# EAGLE design Switch-N-Sense (EAGLE 8.0.1)
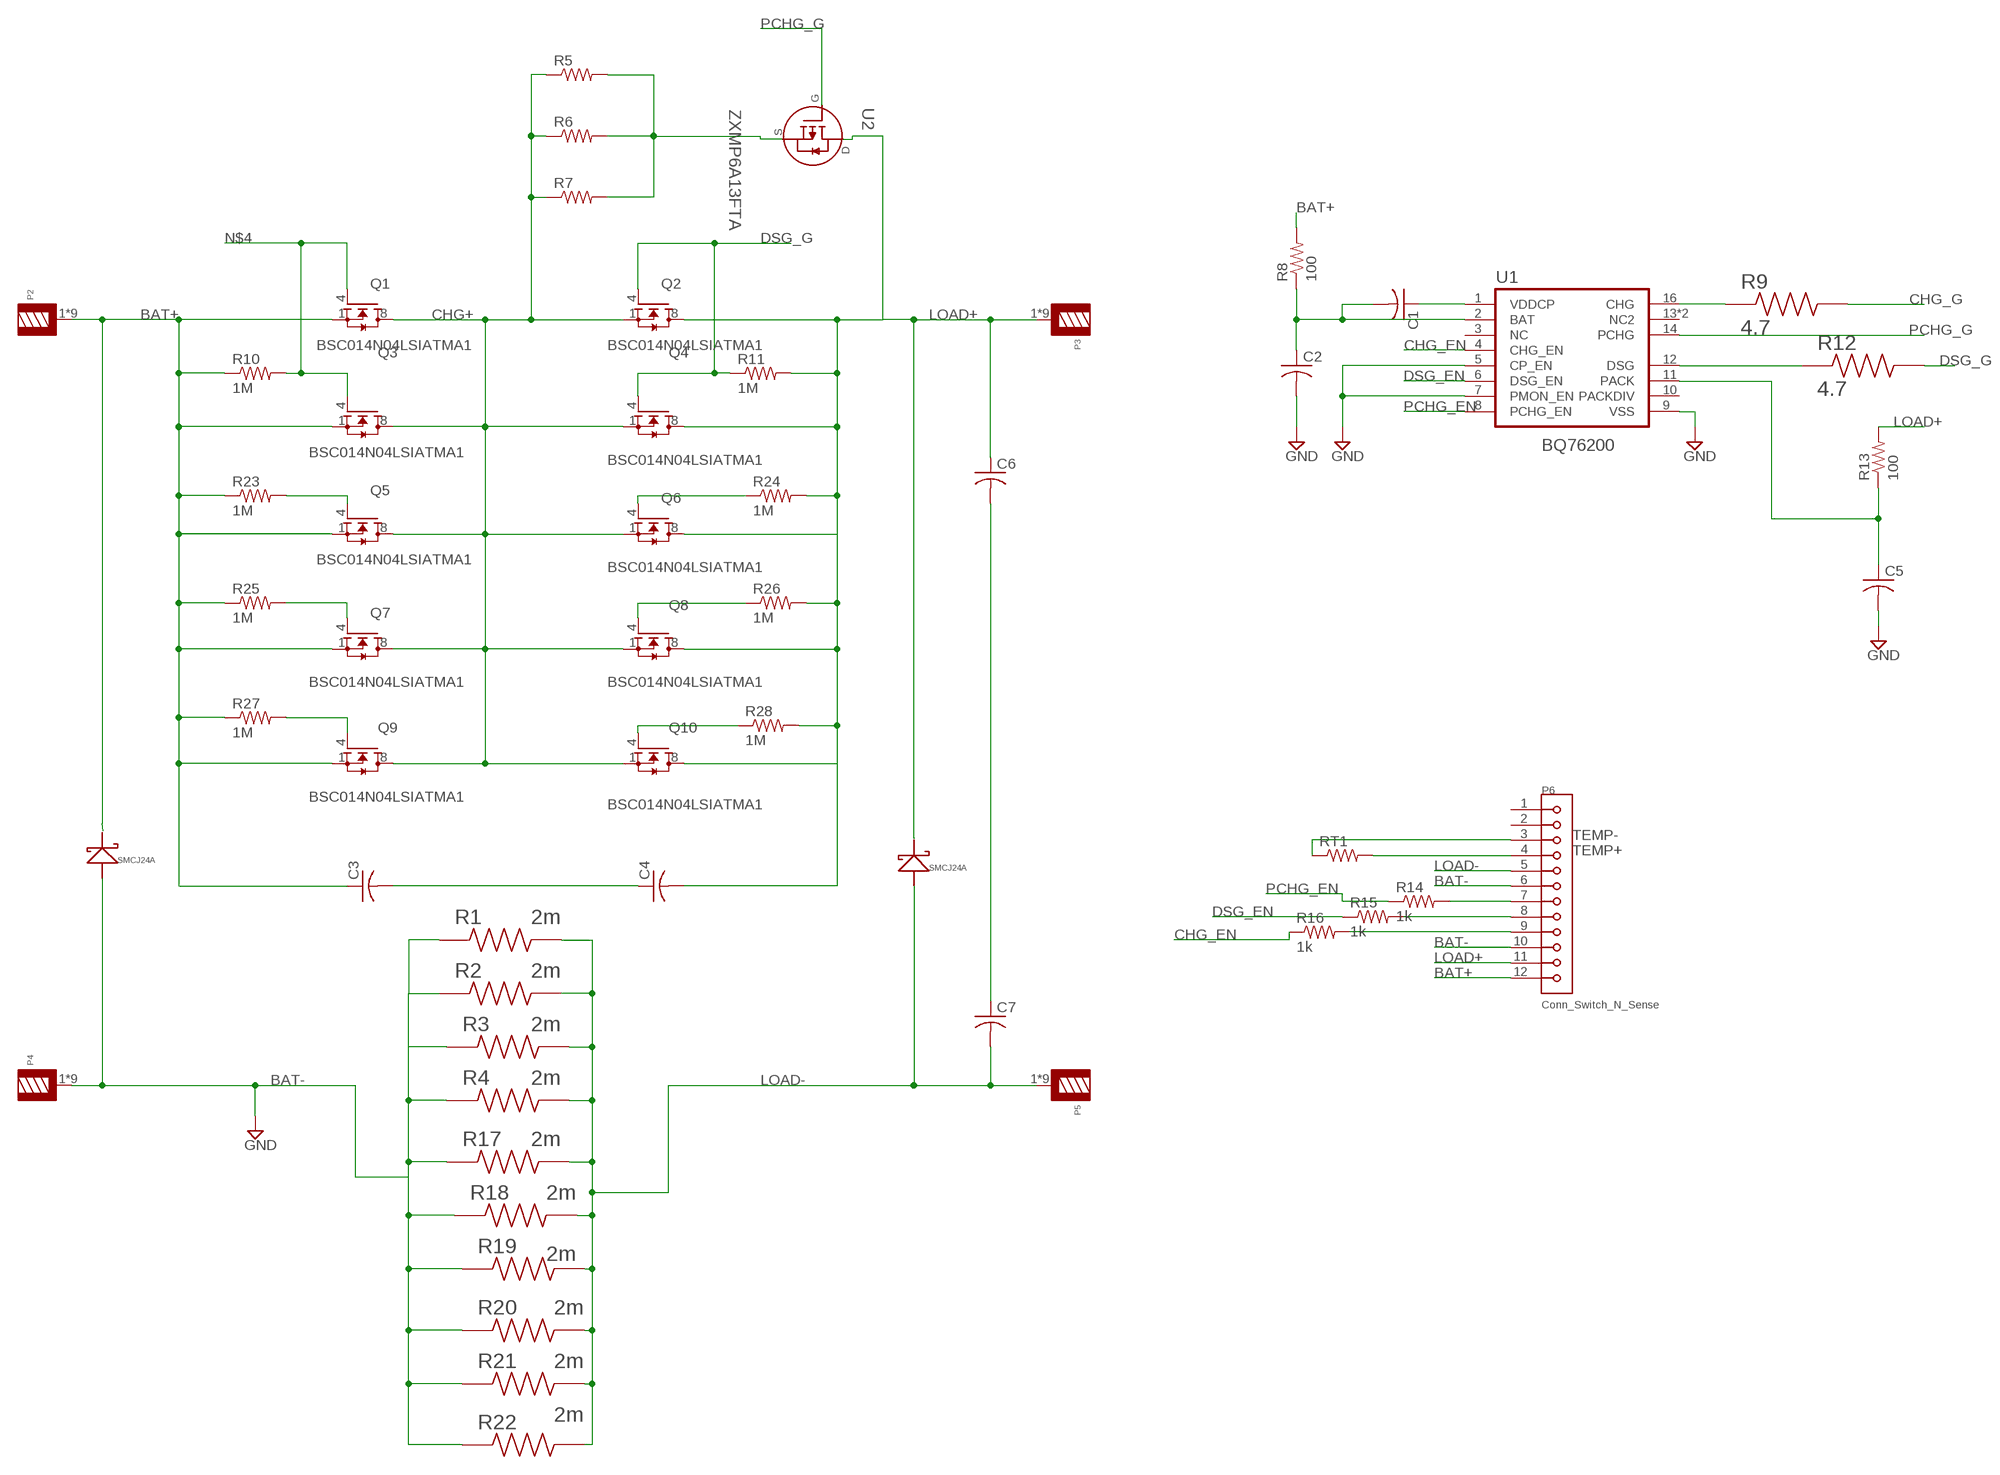
[diagram p0: schematic, sheet 1]

## Parts
C1  C-USC0805  [C0805]
C2  C-USC0603  [C0603]
C3  C-USC0603  [C0603]
C4  C-USC0603  [C0603]
C5  C-USC0603  [C0603]
C6  C-USC0603  [C0603]
C7  C-USC0603  [C0603]
D1  SMCJ24A  [DIOM794X590X262L114X305N]
D2  SMCJ24A  [DIOM794X590X262L114X305N]
P2  WP-THRBU_BLIND-HOLE_74650195  [WP-THRBU_74650195]
P3  WP-THRBU_BLIND-HOLE_74650195  [WP-THRBU_74650195]
P4  WP-THRBU_BLIND-HOLE_74650195  [WP-THRBU_74650195]
P5  WP-THRBU_BLIND-HOLE_74650195  [WP-THRBU_74650195]
P6  Conn_Switch_N_Sense  B12B-ZR-SM4-TF(LF)(SN)  [JST_SM08B-SRSS-TB(LF)(SN)]
Q1  BSC014N04LSIATMA1  [TRANS_BSC014N04LSIATMA1]
Q2  BSC014N04LSIATMA1  [TRANS_BSC014N04LSIATMA1]
Q3  BSC014N04LSIATMA1  [TRANS_BSC014N04LSIATMA1]
Q4  BSC014N04LSIATMA1  [TRANS_BSC014N04LSIATMA1]
Q5  BSC014N04LSIATMA1  [TRANS_BSC014N04LSIATMA1]
Q6  BSC014N04LSIATMA1  [TRANS_BSC014N04LSIATMA1]
Q7  BSC014N04LSIATMA1  [TRANS_BSC014N04LSIATMA1]
Q8  BSC014N04LSIATMA1  [TRANS_BSC014N04LSIATMA1]
Q9  BSC014N04LSIATMA1  [TRANS_BSC014N04LSIATMA1]
Q10  BSC014N04LSIATMA1  [TRANS_BSC014N04LSIATMA1]
R1  2m  CRE2512-FZ-R009E-3  [RESC6432X90N]
R2  2m  CRE2512-FZ-R009E-3  [RESC6432X90N]
R3  2m  CRE2512-FZ-R009E-3  [RESC6432X90N]
R4  2m  CRE2512-FZ-R009E-3  [RESC6432X90N]
R5  R-US_R5025  [R5025]
R6  R-US_R5025  [R5025]
R7  R-US_R5025  [R5025]
R8  100  R-US_R0603  [R0603]
R9  4.7  RC0603FR-074R7L  [RESC1608X55N]
R10  1M  R-US_R0603  [R0603]
R11  1M  R-US_R0603  [R0603]
R12  4.7  RC0603FR-074R7L  [RESC1608X55N]
R13  100  R-US_R0603  [R0603]
R14  1k  R-US_R0603  [R0603]
R15  1k  R-US_R0603  [R0603]
R16  1k  R-US_R0603  [R0603]
R17  2m  CRE2512-FZ-R009E-3  [RESC6432X90N]
R18  2m  CRE2512-FZ-R009E-3  [RESC6432X90N]
R19  2m  CRE2512-FZ-R009E-3  [RESC6432X90N]
R20  2m  CRE2512-FZ-R009E-3  [RESC6432X90N]
R21  2m  CRE2512-FZ-R009E-3  [RESC6432X90N]
R22  2m  CRE2512-FZ-R009E-3  [RESC6432X90N]
R23  1M  R-US_R0603  [R0603]
R24  1M  R-US_R0603  [R0603]
R25  1M  R-US_R0603  [R0603]
R26  1M  R-US_R0603  [R0603]
R27  1M  R-US_R0603  [R0603]
R28  1M  R-US_R0603  [R0603]
RT1  R-US_R0603  [R0603]
U1  MAX5135GUET  [SOP65P640X110-16N]
U2  ZXMP6A13FTA  [SOT95P232X112-3N]

## Nets
BAT+: C3.1 D1.1 P2.1 P2.2 P2.3 P2.4 P2.5 P2.6 P2.7 P2.8 P2.9 P6.12 Q1.1(S) Q3.1(S) Q5.1(S) Q7.1(S) Q9.1(S) R8.2 R10.1 R23.1 R25.1 R27.1
BAT-: D1.2 P4.1 P4.2 P4.3 P4.4 P4.5 P4.6 P4.7 P4.8 P4.9 P6.6 P6.10 R1.1 R2.1 R3.1 R4.1 R17.1 R18.1 R19.1 R20.1 R21.1 R22.1 ; supply symbol labelled GND
CHG+: Q1.8(D) Q2.1(S) Q3.8(D) Q4.1(S) Q5.8(D) Q6.1(S) Q7.8(D) Q8.1(S) Q9.8(D) Q10.1(S) R5.1 R6.1 R7.1
CHG_EN: R16.1 U1.4(CHG_EN)
CHG_G: Q7.4(G) R9.2 R25.2
DSG_EN: R15.1 U1.6(DSG_EN)
DSG_G: Q2.4(G) Q4.4(G) R11.1 R12.2
GND: C2.2 C5.2 U1.5(CP_EN) U1.7(PMON_EN) U1.9(VSS)
LOAD+: C4.2 C6.1 D2.1 P3.1 P3.2 P3.3 P3.4 P3.5 P3.6 P3.7 P3.8 P3.9 P6.11 Q2.8(D) Q4.8(D) Q6.8(D) Q8.8(D) Q10.8(D) R11.2 R13.2 R24.2 R26.2 R28.2 U2.3(D)
LOAD-: C7.2 D2.2 P5.1 P5.2 P5.3 P5.4 P5.5 P5.6 P5.7 P5.8 P5.9 P6.5 R1.2 R2.2 R3.2 R4.2 R17.2 R18.2 R19.2 R20.2 R21.2 R22.2
N$1: R9.1 U1.16(CHG)
N$2: R12.1 U1.12(DSG)
N$3: C5.1 R13.1 U1.11(PACK)
N$4: Q1.4(G) Q3.4(G) R10.2
N$5: Q5.4(G) R23.2
N$6: Q9.4(G) R27.2
N$7: Q10.4(G) R28.1
N$8: Q8.4(G) R26.1
N$9: Q6.4(G) R24.1
N$14: C1.1 U1.1(VDDCP)
N$15: C1.2 C2.1 R8.1 U1.2(BAT)
N$21: P6.7 R14.2
N$22: P6.8 R15.2
N$23: P6.9 R16.2
N$28: C6.2 C7.1
N$29: C3.2 C4.1
N$35: R5.2 R6.2 R7.2 U2.2(S)
PCHG_EN: R14.1 U1.8(PCHG_EN)
PCHG_G: U1.14(PCHG) U2.1(G)
TEMP+: P6.4 RT1.2
TEMP-: P6.3 RT1.1
Unconnected: P6.1 P6.2 U1.3(NC) U1.10(PACKDIV) U1.13(NC2) U1.15(NC2)

## Library data of the parts
C1-C7 = resistor:C-US: CAPACITOR, American symbol
D1 D2 = SMCJ24A:SMCJ24A
P2-P5 = 74650094_Eagle_WP-THRBU_rev19a:WP-THRBU_BLIND-HOLE: WP-THRBU REDCUBE THR with internal blind-hole thread Applications Solderable high current Wire-to-Board connections with a focus on automated assembly Angled assembling of cable or PCBs Angled assembling of PCBs on housings PROPERTIES Material Brass Surface Tin IR 1 50 A;​ 85 A Packaging Unit 450;​ 400 GENERAL INFORMATION Operating Temperature -55 up to +150 °C PACKAGING PROPERTIES Packaging Bulk;​ Tape and Reel <https://katalog.we-online.de/media/images/v2/o84530v209%20Family_WP-THRBU_BLIND_HOLE.jpg> Details see: https://katalog.we-online.de/en/em/WP-THRBU_BLIND_HOLE Updated by Ella Wu 2019-10-16 2019 (C) Wurth Elektronik; DATASHEET-URL: https://katalog.we-online.de/em/datasheet/74650195.pdf; IR: 85A; PART-NUMBER: 74650195; PINS: 9; THREAD: M5
P6 = JST -PH-Pin-12:B12B-ZR-SM4-TF(LF)(SN): Wire-To-Board Connector, ZH Series, Surface Mount, Header, 12, 1.5 mm, Tin Plated Contacts; AVAILABILITY: Unavailable; DESCRIPTION: Connector Header Surface Mount 12 position 0.059 _1.50mm_; MF: JST Sales; MP: B12B-ZR-SM4-TF_LF__SN_; PACKAGE: None; PRICE: None
Q1-Q10 = BSC014N04LS:BSC014N04LSIATMA1: Transistor: N-MOSFET; unipolar; 40V; 100A; 96W; PG-TDSON-8; AVAILABILITY: Unavailable; DESCRIPTION: N-Channel 40V 31A _Ta_, 100A _Tc_ 2.5W _Ta_, 96W _Tc_ Surface Mount PG-TDSON-8 FL; MF: Infineon Technologies; MP: BSC014N04LSIATMA1; PACKAGE: PowerTDFN-8 Infineon; PRICE: None
R1-R4 R17-R22 = CRE2512-FZ-R009E-3:CRE2512-FZ-R009E-3: RES SMD 0.009 OHM 1% 3W 2512; AVAILABILITY: Unavailable; DESCRIPTION: Res Thick Film 2512 9m Ohm 1% 3W ±75ppm/°C Molded SMD Embossed T/R; MF: Bourns; MP: CRE2512-FZ-R009E-3; PACKAGE: 6432 Stackpole; PRICE: None
R5-R8 R10 R11 R13-R16 R23-R28 RT1 = resistor:R-US_: RESISTOR, American symbol
R9 R12 = RC0603FR-074R7L:RC0603FR-074R7L: RES SMD 4.7 OHM 1% 1/10W 0603; AVAILABILITY: Unavailable; DESCRIPTION: Surface Mount Chip Resistor, Thick Film, RC Series, 4.7 ohm, 100 mW, 1%, 50 V, 0603 [1608 Metric]; MF: Yageo; MP: RC0603FR-074R7L; PACKAGE: 1608 Yageo; PRICE: None
U1 = BQ76200PWR:MAX5135GUET; AVAILABILITY: Unavailable; DESCRIPTION: IC DAC 12BIT QUAD 16-TSSOP; MF: Maxim Integrated; MP: MAX5135GUE+; PACKAGE: TSSOP-16 Maxim; PRICE: None
U2 = ZXMP6A13FTA:ZXMP6A13FTA: 60V P-CHANNEL ENHANCEMENT MODE MOSFET; AVAILABILITY: Unavailable; DESCRIPTION: P-Channel 60V 900mA _Ta_ 625mW _Ta_ Surface Mount SOT-23-3; MF: Diodes Inc.; MP: ZXMP6A13FTA; PACKAGE: SOT-23 Diodes Inc.; PRICE: None

## Board
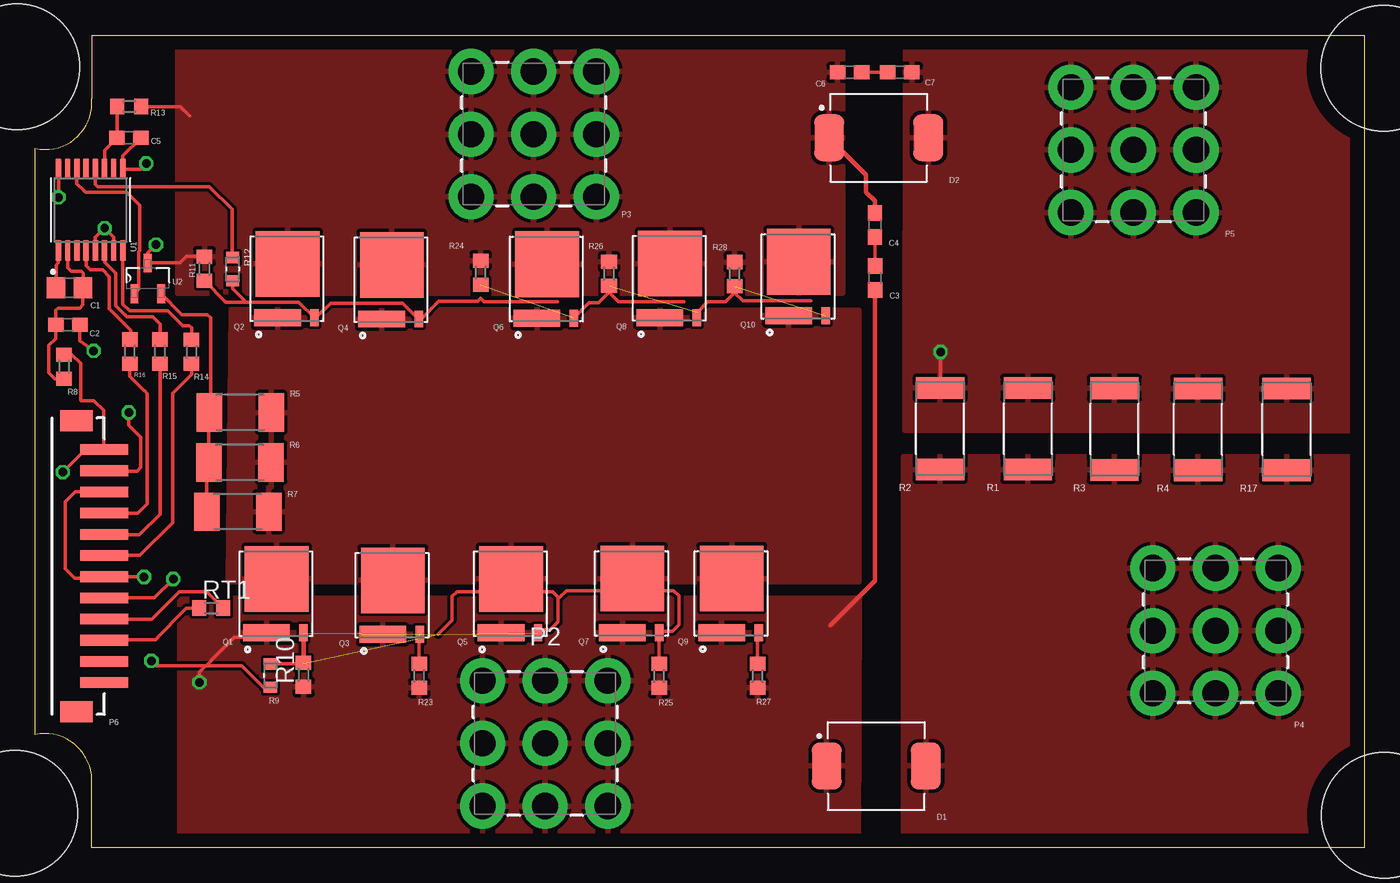
[diagram p1: board, top side]
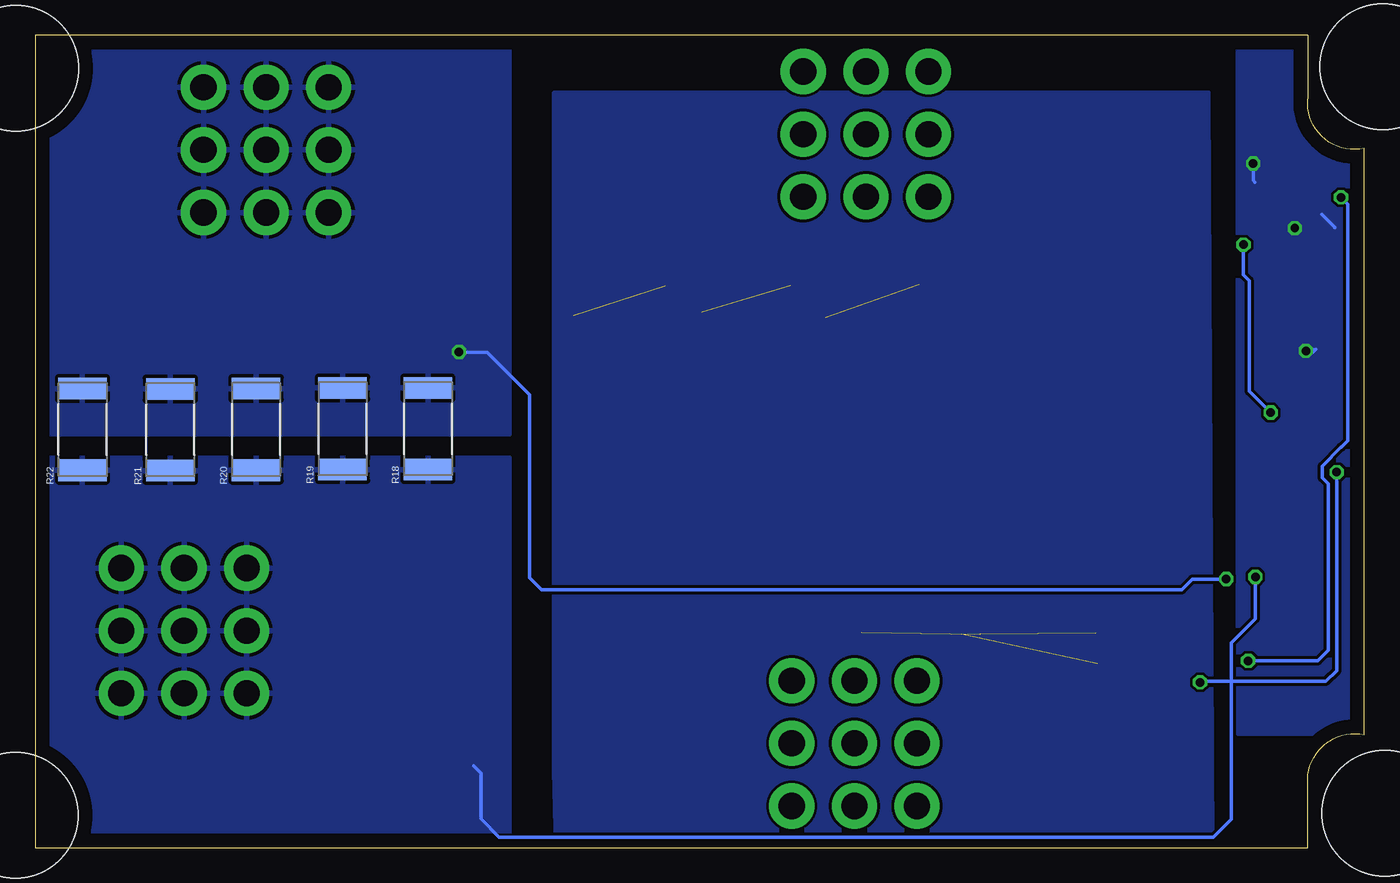
[diagram p2: board, bottom side, seen from below]

Size 94.11 x 57.5 mm. Coordinates in mm from the lower left corner, seen from the top.
Outline: 4,57.5 94.11,57.5 94.11,0 4,0 4,4.5 arc105 0,8 0,49.5 arc107 4,53 4,57.5
Copper layers (1*16): Top 0.035mm / dielectric 1.5mm / Bottom 0.035mm
Design rules "default": minimum track width 10mil, minimum drill 24mil, track to track 8mil, track to pad 8mil, pad to pad 8mil, via to via 8mil, smd to smd 8mil, copper to edge 40mil, drill to drill 8mil, minimum pad ring 10mil, minimum via ring 8mil, stop-mask expansion 4mil, vias tented up to drill 0mil, thermal gap 10mil
Holes 8.89 mm at -1.31,55.26 95.49,55.17 -1.47,2.43 95.54,2.29

### Footprints (pad centres in the part's own frame; a part is rotated, then mirrored left to right if it is on the bottom)
C0805 = smd 1.3 x 1.5: 1 -0.95,0; 2 0.95,0
C0603 = smd 1.1 x 1: 1 -0.85,0; 2 0.85,0
DIOM794X590X262L114X305N = smd 2.13 x 3.32: 1 -3.51,0; 2 3.51,0
WP-THRBU_74650195 = drill 1.85 pad 3.2: 1 -4.435,-4.435; 2 -4.435,4.435; 3 4.435,4.435; 4 4.435,-4.435; 5 -4.435,0; 6 4.435,0; 7 0,-4.435; 8 0,0; 9 0,4.435
JST_SM08B-SRSS-TB(LF)(SN) = smd 0.75 x 3.4: 1 -8.25,-0.5; 2 -6.75,-0.5; 3 -5.25,-0.5; 4 -3.75,-0.5; 5 -2.25,-0.5; 6 -0.75,-0.5; 7 0.75,-0.5; 8 2.25,-0.5; 9 3.75,-0.5; 10 5.25,-0.5; 11 6.75,-0.5; 12 8.25,-0.5 | smd 1.5 x 2.3: P1 -10.3,1.45; P2 10.3,1.45
TRANS_BSC014N04LSIATMA1 = smd 1.2 x 3.3: 1 -2.775,0.66 | smd 1.2 x 0.6: 4 -2.775,-1.96 | smd 4.65 x 4.51: 8 1.05,-0.055
RESC6432X90N = smd 1.54 x 3.42: 1 -2.89,0; 2 2.89,0
R5025 = smd 1.8 x 2.7: 1 -2.2,0; 2 2.2,0
R0603 = smd 1 x 1.1: 1 -0.85,0; 2 0.85,0
RESC1608X55N = smd 0.79 x 0.93: 1 -0.82,0; 2 0.82,0
SOP65P640X110-16N = smd 1.5 x 0.41: 1 -2.885,2.275; 2 -2.885,1.625; 3 -2.885,0.975; 4 -2.885,0.325; 5 -2.885,-0.325; 6 -2.885,-0.975; 7 -2.885,-1.625; 8 -2.885,-2.275; 9 2.885,-2.275; 10 2.885,-1.625; 11 2.885,-0.975; 12 2.885,-0.325; 13 2.885,0.325; 14 2.885,0.975; 15 2.885,1.625; 16 2.885,2.275
SOT95P232X112-3N = smd 1.321 x 0.559: 1 -1.092,0.94; 2 -1.092,-0.94; 3 1.092,0

### Placement (x,y rotation side)
C1  2.43,39.63 0 top
C2  2.3,37.02 0 top
C3  59.47,40.32 90 top
C4  59.45,44.08 90 top
C5  6.64,50.25 0 top
C6  57.67,54.87 0 top
C7  61.23,54.87 0 top
D1  59.55,5.78 0 top
D2  59.73,50.25 0 top
P2  36.11,7.38 0 top
P3  35.29,50.5 0 top
P4  83.58,15.35 0 top
P5  77.76,49.39 0 top
P6  4.38,19.92 90 top
Q1  17.03,17.97 90 top
Q2  17.82,40.27 90 top
Q3  25.26,17.87 90 top
Q4  25.18,40.19 90 top
Q5  33.64,17.97 90 top
Q6  36.18,40.24 90 top
Q7  42.23,17.99 90 top
Q8  44.9,40.29 90 top
Q9  49.26,17.99 90 top
Q10  54.01,40.42 90 top
R1  70.3,29.65 90 top
R2  64.07,29.65 90 top
R3  76.42,29.63 90 top
R4  82.33,29.6 90 top
R5  14.52,30.79 180 top
R6  14.49,27.26 180 top
R7  14.34,23.78 180 top
R8  2.05,34.05 90 top
R9  16.65,12.18 90 top
R10  18.99,12.23 90 top
R11  11.98,40.98 90 top
R12  13.98,40.95 270 top
R13  6.64,52.46 0 top
R14  11.06,35.09 270 top
R15  8.83,35.11 270 top
R16  6.69,35.11 270 top
R17  88.61,29.6 90 top
R18  66.31,29.65 90 bottom
R19  72.35,29.65 90 bottom
R20  78.47,29.6 90 bottom
R21  84.54,29.58 90 bottom
R22  90.77,29.6 90 bottom
R23  27.19,12.15 90 top
R24  31.53,40.7 90 top
R25  44.18,12.15 90 top
R26  40.63,40.62 90 top
R27  51.14,12.15 90 top
R28  49.52,40.6 90 top
RT1  12.46,16.95 0 top
U1  3.92,45.15 90 top
U2  7.96,40.29 90 top

### Tracks (layer width: path | path; a pad name or v marks a point on that pad's centre or on a via)
BAT+  (via drill 0.6)
  Top 0.254: R8.2 2.59,34.9 3.21,34.27 3.21,31.68 3.26,31.63 4.15,31.63 4.84,30.95 4.84,28.22 P6.12 3.54,28.17 v1.94,26.58 | v11.62,11.69 11.62,12.41 12.49,13.27 12.49,13.29 14.09,14.89 16.07,14.89 Q1.1
  Top 0.305: C3.1 59.48,18.88 56.33,15.73
  Bottom 0.254: v1.94,26.58 1.94,12.53 2.71,11.77 11.55,11.77 v11.62,11.69
  pour Top: 58.35,17.65 58.29,0.23 10.22,0.05 10.21,17.66
BAT-  (via drill 0.6)
  Top 0.254: P6.10 2.83,25.17 2.12,24.47 2.12,19.72 2.78,19.06 4.77,19.06 P6.6 v7.7,19.17 v7.71,19.16
  Bottom 0.254: v7.71,19.16 7.71,16.19 9.41,14.49 9.41,2.02 10.68,0.75 61.25,0.75 62.55,2.04 62.55,5.26 D1.2
  pour Top: 94.51,27.68 94.42,-0.38 61.46,-0.48 61.47,27.68
  pour Bottom: 93.43,-0.14 60.54,-0.17 60.54,27.57 94.32,27.57 94.32,-0.14
CHG+
  pour Top: 58.34,38.05 58.34,18.81 13.66,18.82 13.88,38.12
  pour Bottom: 57.34,53.4 57.34,5.47 57.19,0.04 10.78,-0.07 11.06,53.43
CHG_EN
  Top 0.254: U1.4 3.6,41.18 3.87,40.9 4.76,40.9 5.25,40.42 5.25,38.16 6.77,36.64 6.77,36.04 R16.1
CHG_G  (1 unrouted)
  Top 0.254: R25.2 Q7.4 44.3,15.33 45.12,15.33 45.58,15.78 45.58,17.82 45.2,18.2 37.61,18.2 37.12,17.71 37.02,17.71 | 28.53,15.09 29.53,16.09 29.53,17.79 29.86,18.12 36.62,18.12 37.02,17.71 | 37.02,17.71 37.02,15.99 36.46,15.43 35.84,15.43 | R9.2 18.91,13
DSG_EN
  Top 0.254: U1.6 4.9,41.43 5.68,40.65 5.68,38.36 6.34,37.7 6.36,37.7 6.49,37.58 8.32,37.58 8.85,37.04 8.85,35.99 R15.1
DSG_G
  Top 0.254: 36.97,38.64 31.79,38.64 31.54,38.9 31.31,38.67 28.56,38.67 27.31,37.42 Q4.4 26.02,38.54 20.92,38.54 19.87,37.49 Q2.4 18.66,38.62 14.92,38.62 | R11.1 13.49,38.62 14.92,38.62 | R12.2 13.98,39.56 14.92,38.62
GND  (via drill 0.6)
  Top 0.254: C5.2 6.2,48.96 U1.9 7.47,48.03 v7.86,48.42 | 4.25,43.11 U1.5 4.25,43.2 4.26,43.2 v4.92,43.85 5.55,43.22 U1.7 | C2.2 3.15,35.89 v4.13,35.16
  Bottom 0.254: v7.86,48.42 7.86,47.23 7.74,47.1 | 2.1,43.88 2.1,43.93 3.01,44.84 | v4.13,35.16 3.44,35.27 3.8,34.91
  pour Bottom: 8.9,57.62 8.9,8.09 3.62,8.09 3.19,8.09 arc-90 2.93,8.34 arc103 2.45,8.72 0.06,8.72 0.06,49.29 1.08,49.29 arc90 3.9,52.11 3.9,57.62 8.85,57.62
LOAD+  (via drill 0.6)
  Top 0.254: R11.2 11.96,41.84 10.71,41.84 10.25,41.39 U2.3 7.96,42.1 v8.55,42.68 | R13.2 10.28,52.46 10.94,51.8 | v6.62,30.79 6.62,29.88 7.46,29.04 7.46,26.91 7.2,26.65 4.9,26.65 P6.11
  Top 0.305: C4.2 59.45,45.78 58.84,46.39 58.84,47.63 D2.1
  Bottom 0.254: v8.55,42.68 8.55,40.55 8.14,40.14 8.14,32.32 v6.62,30.79
  pour Top: 57.15,57.78 57.15,39.25 10.09,39.24 10.09,57.84
LOAD-  (via drill 0.6)
  Top 0.254: P6.5 8.43,17.67 v9.77,19.01 | v64.1,35.09 64.1,32.57 R2.2
  Bottom 0.254: v9.77,19.01 12.15,19.01 12.92,18.25 58.26,18.25 59.12,19.11 59.12,32.06 62.12,35.06 64.07,35.06 v64.1,35.09
  pour Bottom: 94.32,57.64 94.32,29.3 60.54,29.3 60.54,57.67
  pour Top: 94.41,57.95 94.58,29.48 61.59,29.54 61.62,57.87
N$1  (via drill 0.6)
  Top 0.254: R9.1 16.15,11.36 14.62,12.89 8.55,12.89 v8.22,13.22 | U1.16 1.65,46.05 v1.64,46.03
  Bottom 0.254: v8.22,13.22 3.29,13.22 2.83,13.68 2.55,13.95 2.55,25.74 2.99,26.17 2.99,27.01 1.66,28.33 1.64,28.33 1.16,28.81 1.16,45.55 v1.64,46.03
N$2
  Top 0.254: U1.12 4.25,46.95 4.41,46.8 12.31,46.8 13.93,45.17 13.93,41.83 R12.1
N$3
  Top 0.254: U1.11 4.9,49.36 C5.1 R13.1
N$4  (1 unrouted)
  Top 0.305: R10.2 Q1.4
N$5  (1 unrouted)
  Top 0.254: 27.19,15.06 R23.2 27.12,13.08
N$6
  Top 0.254: R27.2 51.14,15.14 Q9.4
N$7  (1 unrouted)
N$8  (1 unrouted)
  Top 0.254: 54.93,38.69 50.1,38.69 49.52,39.28 48.88,38.64 47.61,38.64 46.88,37.91 Q8.4
N$9  (1 unrouted)
  Top 0.254: 45.93,38.64 41.29,38.64 40.63,39.3 39.89,38.57 39.21,38.57 38.14,37.5 Q6.4
N$14
  Top 0.254: C1.1 1.48,41.22 1.64,41.39 1.64,42.25 U1.1
N$15
  Top 0.254: U1.2 2.3,41.03 2.53,40.8 3.24,40.8 3.38,40.67 C1.2 3.37,38.41 3.14,38.19 1.61,38.19 1.45,38.02 C2.1 1.44,36.03 0.95,35.54 0.95,33.61 1.37,33.2 R8.1
N$21
  Top 0.254: R14.2 11.06,33.51 9.72,32.17 9.72,23 7.41,20.69 4.89,20.69 P6.7
N$22
  Top 0.254: R15.2 8.83,23.61 7.35,22.13 4.92,22.13 P6.8
N$23
  Top 0.254: P6.9 7.27,23.67 7.94,24.34 7.94,32.14 7.74,32.34 7.71,32.34 6.69,33.36 R16.2
N$28
  Top 0.254: C6.2 C7.1
N$29
  Top 0.254: C4.1 59.45,41.2 C3.2
N$35
  Top 0.254: U2.2 10.38,37.73 12.18,37.73 12.41,37.5 12.41,30.89 R5.2 12.29,30.77 R6.2 12.14,27.11 R7.2
PCHG_EN
  Top 0.254: U1.8 6.2,38.48 6.67,38.01 9.39,38.01 10.45,36.94 10.91,36.94 11.06,36.79 R14.1
PCHG_G
  Top 0.254: U1.14 2.95,47.01 3.42,46.54 3.42,46.52 3.47,46.47 3.49,46.47 3.57,46.39 6.49,46.39 7.41,45.48 7.41,42.25 7.33,42.17 7.33,39.51 U2.1
TEMP+
  Top 0.254: P6.4 8.25,16.17 10.2,18.12 12.14,18.12 RT1.2
TEMP-
  Top 0.254: RT1.1 10.68,16.95 9.54,15.81 9.54,15.76 8.68,14.89 8.68,14.87 8.52,14.72 4.93,14.72 P6.3